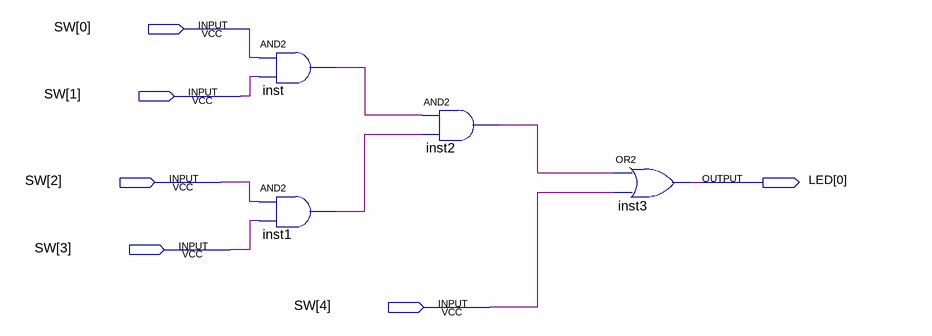
[diagram p0: schematic sheet]
// Quartus schematic File1.bdf as structural Verilog: 4 symbols, 6 pins
module File1 (
  input  [4:0] SW,
  output [0:0] LED
);

  wire inst1_out, inst2_out, inst_out;

  and inst (inst_out, SW[0], SW[1]);
  and inst1 (inst1_out, SW[2], SW[3]);
  and inst2 (inst2_out, inst_out, inst1_out);
  or inst3 (LED[0], inst2_out, SW[4]);
endmodule
